# Altium schematic sheet DigitalInterfaces.SchDoc: Digital Interfaces
size A4; Author: João Guimarães; DocumentNumber: 9; Revision: 2.0; DocumentName: 9
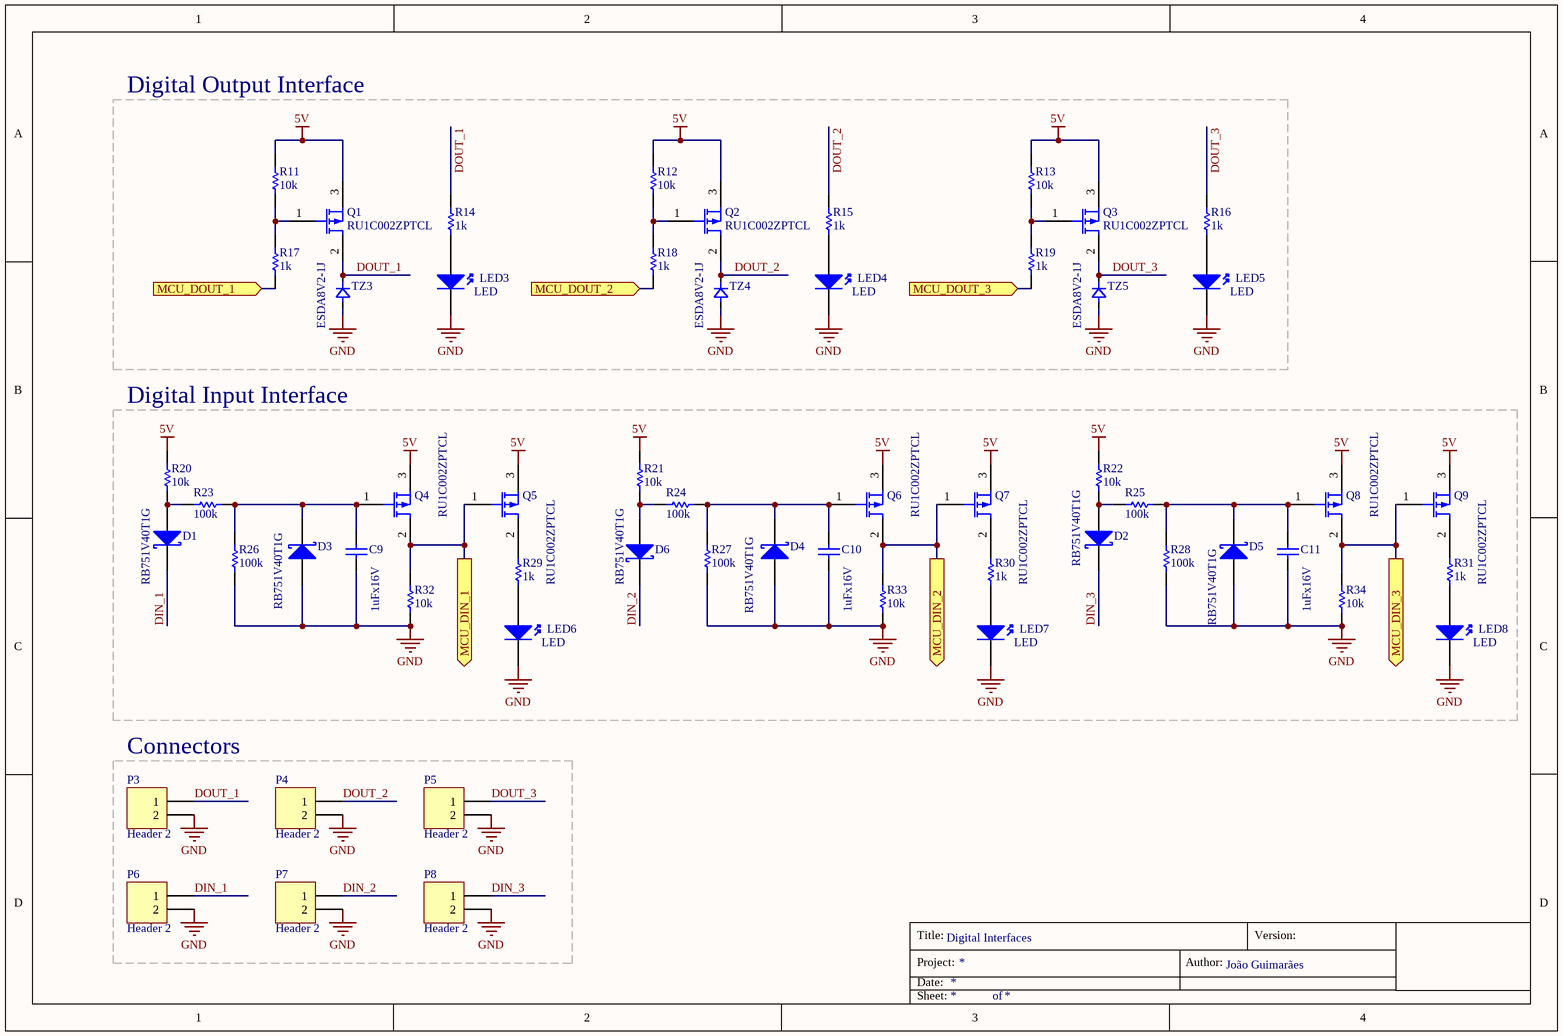
[diagram p0: DigitalInterfaces.SchDoc]

## Parts
C9  1uFx16V  [DISC-0805]
C10  1uFx16V  [DISC-0805]
C11  1uFx16V  [DISC-0805]
D1  RB751V40T1G  [DISC-SOD-323]
D2  RB751V40T1G  [DISC-SOD-323]
D3  RB751V40T1G  [DISC-SOD-323]
D4  RB751V40T1G  [DISC-SOD-323]
D5  RB751V40T1G  [DISC-SOD-323]
D6  RB751V40T1G  [DISC-SOD-323]
LED3  LED  [DISC-LED-0.1-PTH]
LED4  LED  [DISC-LED-0.1-PTH]
LED5  LED  [DISC-LED-0.1-PTH]
LED6  LED  [DISC-LED-0.1-PTH]
LED7  LED  [DISC-LED-0.1-PTH]
LED8  LED  [DISC-LED-0.1-PTH]
P3  Header 2  [CON-FLEXWIRE-0.5MM2-1X2]
P4  Header 2  [CON-FLEXWIRE-0.5MM2-1X2]
P5  Header 2  [CON-FLEXWIRE-0.5MM2-1X2]
P6  Header 2  [CON-FLEXWIRE-0.5MM2-1X2]
P7  Header 2  [CON-FLEXWIRE-0.5MM2-1X2]
P8  Header 2  [CON-FLEXWIRE-0.5MM2-1X2]
Q1  RU1C002ZPTCL  [DISC-SOT-23]
Q2  RU1C002ZPTCL  [DISC-SOT-23]
Q3  RU1C002ZPTCL  [DISC-SOT-23]
Q4  RU1C002ZPTCL  [DISC-SOT-23]
Q5  RU1C002ZPTCL  [DISC-SOT-23]
Q6  RU1C002ZPTCL  [DISC-SOT-23]
Q7  RU1C002ZPTCL  [DISC-SOT-23]
Q8  RU1C002ZPTCL  [DISC-SOT-23]
Q9  RU1C002ZPTCL  [DISC-SOT-23]
R11  10k  [DISC-0805]
R12  10k  [DISC-0805]
R13  10k  [DISC-0805]
R14  1k  [DISC-0805]
R15  1k  [DISC-0805]
R16  1k  [DISC-0805]
R17  1k  [DISC-0805]
R18  1k  [DISC-0805]
R19  1k  [DISC-0805]
R20  10k  [DISC-0805]
R21  10k  [DISC-0805]
R22  10k  [DISC-0805]
R23  100k  [DISC-0805]
R24  100k  [DISC-0805]
R25  100k  [DISC-0805]
R26  100k  [DISC-0805]
R27  100k  [DISC-0805]
R28  100k  [DISC-0805]
R29  1k  [DISC-0805]
R30  1k  [DISC-0805]
R31  1k  [DISC-0805]
R32  10k  [DISC-0805]
R33  10k  [DISC-0805]
R34  10k  [DISC-0805]
TZ3  ESDA8V2-1J  [DISC-SOD-323]
TZ4  ESDA8V2-1J  [DISC-SOD-323]
TZ5  ESDA8V2-1J  [DISC-SOD-323]

## Blocks framed on the sheet
Digital Output Interface: LED3-LED5 Q1-Q3 R11-R19 TZ3-TZ5
Digital Input Interface: C9-C11 D1-D6 LED6-LED8 Q4-Q9 R20-R34
Connectors: P3-P8

## Ports
MCU_DIN_1 (out), MCU_DIN_2 (out), MCU_DIN_3 (out), MCU_DOUT_1 (in), MCU_DOUT_2 (in), MCU_DOUT_3 (in)

## Nets
5V: Q1.3(S) Q2.3(S) Q3.3(S) Q4.3(S) Q5.3(S) Q6.3(S) Q7.3(S) Q8.3(S) Q9.3(S) R11.1 R12.1 R13.1 R20.1 R21.1 R22.1
GND: C9.1 C10.1 C11.1 D3.1(A) D4.1(A) D5.1(A) LED3.2(K) LED4.2(K) LED5.2(K) LED6.2(K) LED7.2(K) LED8.2(K) P3.2 P4.2 P5.2 P6.2 P7.2 P8.2 R26.1 R27.1 R28.1 R32.1 R33.1 R34.1 TZ3.1(A) TZ4.1(A) TZ5.1(A)
DIN_1: D1.2(K) P6.1
DIN_2: D6.2(K) P7.1
DIN_3: D2.2(K) P8.1
DOUT_1: P3.1 Q1.2(D) R14.2 TZ3.2(C)
DOUT_2: P4.1 Q2.2(D) R15.2 TZ4.2(C)
DOUT_3: P5.1 Q3.2(D) R16.2 TZ5.2(C)
MCU_DIN_1: Q4.2(D) Q5.1(G) R32.2 ; port MCU_DIN_1
MCU_DIN_2: Q6.2(D) Q7.1(G) R33.2 ; port MCU_DIN_2
MCU_DIN_3: Q8.2(D) Q9.1(G) R34.2 ; port MCU_DIN_3
MCU_DOUT_1: R17.2 ; port MCU_DOUT_1
MCU_DOUT_2: R18.2 ; port MCU_DOUT_2
MCU_DOUT_3: R19.2 ; port MCU_DOUT_3
NetC9_2: C9.2 D3.2(K) Q4.1(G) R23.1 R26.2
NetC10_2: C10.2 D4.2(K) Q6.1(G) R24.2 R27.2
NetC11_2: C11.2 D5.2(K) Q8.1(G) R25.2 R28.2
NetD1_1: D1.1(A) R20.2 R23.2
NetD2_1: D2.1(A) R22.2 R25.1
NetD6_1: D6.1(A) R21.2 R24.1
NetLED3_1: LED3.1(A) R14.1
NetLED4_1: LED4.1(A) R15.1
NetLED5_1: LED5.1(A) R16.1
NetLED6_1: LED6.1(A) R29.1
NetLED7_1: LED7.1(A) R30.1
NetLED8_1: LED8.1(A) R31.1
NetQ1_1: Q1.1(G) R11.2 R17.1
NetQ2_1: Q2.1(G) R12.2 R18.1
NetQ3_1: Q3.1(G) R13.2 R19.1
NetQ5_2: Q5.2(D) R29.2
NetQ7_2: Q7.2(D) R30.2
NetQ9_2: Q9.2(D) R31.2

## Notes on the sheet
- Title:
- Project:
- Date:
- Author:
- Version:
- Sheet:
- of

## Library data of the parts
C9-C11 = Cap: Capacitor
D1-D6 = D Schottky: Schottky Diode; Published: 8-Jun-2000; LatestRevisionDate: 17-Jul-2002; LatestRevisionNote: Re-released for DXP Platform.; PackageReference: SMB; Publisher: Altium Limited; PackageDescription: DO-214-AA/SMB; 2 C-Bend Leads; Body 5.3 x 3.6 mm, inc. leads (LxW); Code_JEDEC: DO-214-AA
P3-P8 = Header 2: Header, 2-Pin; LatestRevisionDate: 17-Jul-2002; LatestRevisionNote: Re-released for DXP Platform.; Publisher: Altium Limited
Q1-Q9 = Transistor-PMOS: P-Channel MOSFET
R11-R34 = Res: Resistor
TZ3-TZ5 = TVZ-Unidirectional